# Altium schematic sheet stepper1.SchDoc
size A4
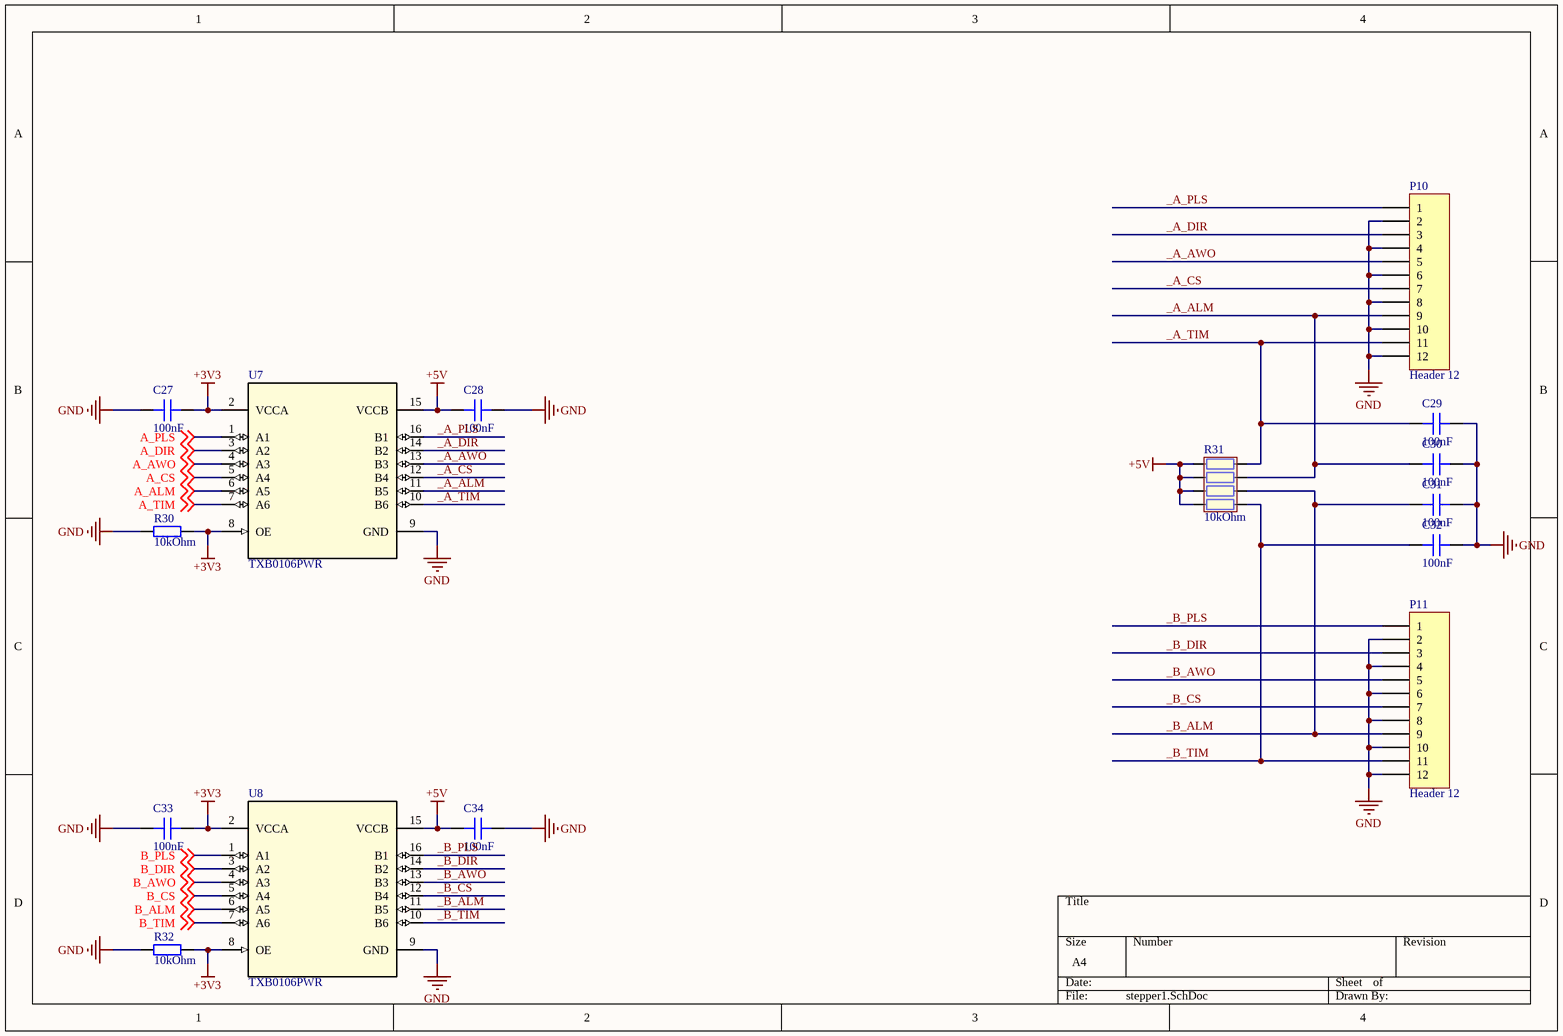
[diagram p0: stepper1.SchDoc]

## Parts
C27  value 100nF  [CAPC2012-0805]  (hidden comment: Non-polar capacitor)
C28  value 100nF  [CAPC2012-0805]  (hidden comment: Non-polar capacitor)
C29  value 100nF  [CAPC2012-0805]  (hidden comment: Non-polar capacitor)
C30  value 100nF  [CAPC2012-0805]  (hidden comment: Non-polar capacitor)
C31  value 100nF  [CAPC2012-0805]  (hidden comment: Non-polar capacitor)
C32  value 100nF  [CAPC2012-0805]  (hidden comment: Non-polar capacitor)
C33  value 100nF  [CAPC2012-0805]  (hidden comment: Non-polar capacitor)
C34  value 100nF  [CAPC2012-0805]  (hidden comment: Non-polar capacitor)
P10  Header 12  [MOLEX 53426-1210]
P11  Header 12  [MOLEX 53426-1210]
R30  value 10kOhm  [RESC2012-0805]  (hidden comment: Resistor)
R31  10kOhm  [RES 0603 4PACK]
R32  value 10kOhm  [RESC2012-0805]  (hidden comment: Resistor)
U7  TXB0106PWR  [TSSOP-16]
U8  TXB0106PWR  [TSSOP-16]

## Nets
+3V3: C27.2 C33.2 R30.1 R32.1 U7.2(VCCA) U7.8(OE) U8.2(VCCA) U8.8(OE)
+5V: C28.1 C34.1 R31.1 R31.2 R31.3 R31.4 U7.15(VCCB) U8.15(VCCB)
GND: C27.1 C28.2 C29.2 C30.2 C31.2 C32.2 C33.1 C34.2 P10.2 P10.4 P10.6 P10.8 P10.10 P10.12 P11.2 P11.4 P11.6 P11.8 P11.10 P11.12 R30.2 R32.2 U7.9(GND) U8.9(GND)
_A_ALM: C30.1 P10.9 R31.7 U7.11(B5)
_A_AWO: P10.5 U7.13(B3)
_A_CS: P10.7 U7.12(B4)
_A_DIR: P10.3 U7.14(B2)
_A_PLS: P10.1 U7.16(B1)
_A_TIM: C29.1 P10.11 R31.8 U7.10(B6)
_B_ALM: C31.1 P11.9 R31.6 U8.11(B5)
_B_AWO: P11.5 U8.13(B3)
_B_CS: P11.7 U8.12(B4)
_B_DIR: P11.3 U8.14(B2)
_B_PLS: P11.1 U8.16(B1)
_B_TIM: C32.1 P11.11 R31.5 U8.10(B6)
A_ALM: U7.6(A5) ; off-sheet A_ALM
A_AWO: U7.4(A3) ; off-sheet A_AWO
A_CS: U7.5(A4) ; off-sheet A_CS
A_DIR: U7.3(A2) ; off-sheet A_DIR
A_PLS: U7.1(A1) ; off-sheet A_PLS
A_TIM: U7.7(A6) ; off-sheet A_TIM
B_ALM: U8.6(A5) ; off-sheet B_ALM
B_AWO: U8.4(A3) ; off-sheet B_AWO
B_CS: U8.5(A4) ; off-sheet B_CS
B_DIR: U8.3(A2) ; off-sheet B_DIR
B_PLS: U8.1(A1) ; off-sheet B_PLS
B_TIM: U8.7(A6) ; off-sheet B_TIM

## Library data of the parts
C27-C34 = Cap: Capacitor; Published: 8-Jun-2000; LatestRevisionDate: 17-Jul-2002; LatestRevisionNote: Re-released for DXP Platform.; PackageReference: RAD-0.3; Publisher: Altium Limited; PackageDescription: Radial Cap, Thru-Hole; 2 Leads; 0.3 in Pin Spacing
P10 P11 = Header 12: Header, 12-Pin; LatestRevisionDate: 17-Jul-2002; LatestRevisionNote: Re-released for DXP Platform.; Publisher: Altium Limited
R30 R32 = Res: Published: 8-Jun-2000; LatestRevisionDate: 17-Jul-2002; LatestRevisionNote: Re-released for DXP Platform.; PackageReference: AXIAL-0.4; Publisher: Altium Limited; PackageDescription: Axial Device, Thru-Hole; 2 Leads; 0.4 in Pin Spacing
R31 = Res 4Pack
U7 U8 = TXB0106PWR: No Description Available; Manufacturer: Texas Instruments; CompType: IC; PIN_COUNT: 16; PartNumber: TXB0106PWR; PackageReference: PW0016A; MountType: SMT; RoHS: Y; RefDes: RefDes; Type: DEV; Value: Value; Copyright: Copyright (C) 2021 Accelerated Designs. All rights reserved